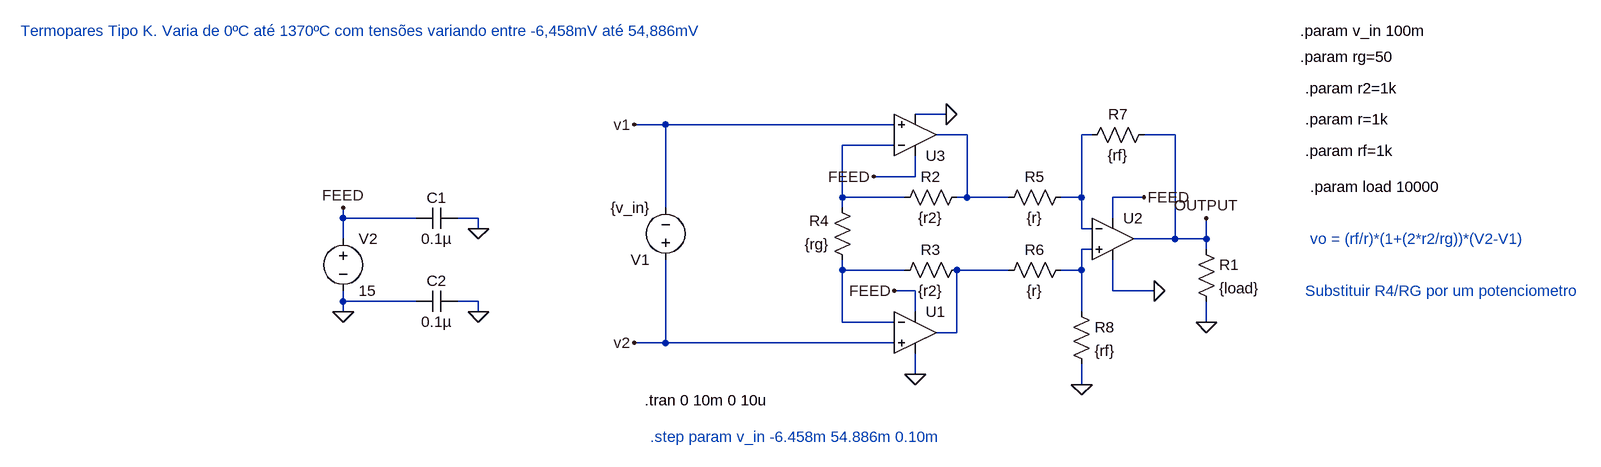
[diagram p0: schematic Amplificador_Instrumentacao.asc]
Amplificador_Instrumentacao.asc, the LTspice schematic file:
Version 4.1
SHEET 1 880 836
WIRE -480 288 -528 288
WIRE -912 304 -960 304
WIRE -560 304 -912 304
WIRE -448 320 -496 320
WIRE -256 320 -272 320
WIRE -128 320 -176 320
WIRE -560 336 -640 336
WIRE -528 384 -528 352
WIRE -528 384 -592 384
WIRE -640 416 -640 336
WIRE -544 416 -640 416
WIRE -448 416 -448 320
WIRE -448 416 -464 416
WIRE -384 416 -448 416
WIRE -272 416 -272 320
WIRE -272 416 -304 416
WIRE -176 416 -224 416
WIRE -912 432 -912 304
WIRE -640 432 -640 416
WIRE -1408 448 -1408 432
WIRE -1296 448 -1408 448
WIRE -1200 448 -1232 448
WIRE -224 448 -224 416
WIRE -1200 464 -1200 448
WIRE -272 464 -272 416
WIRE -256 464 -272 464
WIRE -1408 480 -1408 448
WIRE -128 480 -128 320
WIRE -128 480 -192 480
WIRE -80 480 -80 448
WIRE -80 480 -128 480
WIRE -256 496 -272 496
WIRE -80 496 -80 480
WIRE -640 528 -640 512
WIRE -544 528 -640 528
WIRE -384 528 -464 528
WIRE -272 528 -272 496
WIRE -272 528 -304 528
WIRE -528 560 -560 560
WIRE -224 560 -224 512
WIRE -160 560 -224 560
WIRE -1408 576 -1408 560
WIRE -1296 576 -1408 576
WIRE -1200 576 -1232 576
WIRE -1408 592 -1408 576
WIRE -1200 592 -1200 576
WIRE -528 592 -528 560
WIRE -272 592 -272 528
WIRE -640 608 -640 528
WIRE -560 608 -640 608
WIRE -80 608 -80 576
WIRE -464 624 -464 528
WIRE -464 624 -496 624
WIRE -912 640 -912 512
WIRE -912 640 -960 640
WIRE -560 640 -912 640
WIRE -528 688 -528 656
WIRE -272 704 -272 672
FLAG -1408 432 FEED
FLAG -1408 592 0
FLAG -272 704 0
FLAG -480 288 0
FLAG -528 688 0
FLAG -160 560 0
FLAG -592 384 FEED
FLAG -560 560 FEED
FLAG -176 416 FEED
FLAG -80 608 0
FLAG -80 448 OUTPUT
FLAG -960 640 v2
FLAG -960 304 v1
FLAG -1200 464 0
FLAG -1200 592 0
SYMBOL OpAmps\\UniversalOpAmp -528 624 R0
SYMATTR InstName U1
SYMBOL OpAmps\\UniversalOpAmp -224 480 R0
SYMATTR InstName U2
SYMBOL OpAmps\\UniversalOpAmp -528 320 M180
SYMATTR InstName U3
SYMBOL res -448 400 R90
WINDOW 0 0 56 VBottom 2
WINDOW 3 32 56 VTop 2
SYMATTR InstName R2
SYMATTR Value {r2}
SYMBOL res -448 512 R90
WINDOW 0 0 56 VBottom 2
WINDOW 3 32 56 VTop 2
SYMATTR InstName R3
SYMATTR Value {r2}
SYMBOL res -624 528 R180
WINDOW 0 36 76 Left 2
WINDOW 3 36 40 Left 2
SYMATTR InstName R4
SYMATTR Value {rg}
SYMBOL res -400 432 R270
WINDOW 0 32 56 VTop 2
WINDOW 3 0 56 VBottom 2
SYMATTR InstName R5
SYMATTR Value {r}
SYMBOL res -400 544 R270
WINDOW 0 32 56 VTop 2
WINDOW 3 0 56 VBottom 2
SYMATTR InstName R6
SYMATTR Value {r}
SYMBOL res -272 336 R270
WINDOW 0 32 56 VTop 2
WINDOW 3 0 56 VBottom 2
SYMATTR InstName R7
SYMATTR Value {rf}
SYMBOL res -288 576 R0
SYMATTR InstName R8
SYMATTR Value {rf}
SYMBOL voltage -912 528 R180
WINDOW 123 0 0 Left 0
WINDOW 39 0 0 Left 0
SYMATTR InstName V1
SYMATTR Value {v_in}
SYMBOL res -96 480 R0
SYMATTR InstName R1
SYMATTR Value {load}
SYMBOL voltage -1408 464 R0
WINDOW 123 0 0 Left 0
WINDOW 39 0 0 Left 0
SYMATTR InstName V2
SYMATTR Value 15
SYMBOL cap -1232 432 R90
WINDOW 0 0 32 VBottom 2
WINDOW 3 32 32 VTop 2
SYMATTR InstName C1
SYMATTR Value 0.1µ
SYMBOL cap -1232 560 R90
WINDOW 0 0 32 VBottom 2
WINDOW 3 32 32 VTop 2
SYMATTR InstName C2
SYMATTR Value 0.1µ
TEXT 64 160 Left 2 !.param v_in 100m
TEXT 64 200 Left 2 !.param rg=50
TEXT 72 248 Left 2 !.param r2=1k
TEXT 72 296 Left 2 !.param r=1k
TEXT 72 344 Left 2 !.param rf=1k
TEXT 80 400 Left 2 !.param load 10000
TEXT 80 480 Left 2 ;vo = (rf/r)*(1+(2*r2/rg))*(V2-V1)
TEXT -944 728 Left 2 !.tran 0 10m 0 10u
TEXT 72 560 Left 2 ;Substituir R4/RG por um potenciometro
TEXT -1904 160 Left 2 ;Termopares Tipo K. Varia de 0ºC até 1370ºC com tensões variando entre -6,458mV até 54,886mV
TEXT -936 784 Left 2 ;.step param v_in -6.458m 54.886m 0.10m

The netlist it stands for:
* Amplificador_Instrumentacao.asc
X§U1 v2 N005 FEED 0 N006 level1 Avol=1Meg GBW=10Meg Vos=0 En=0 Enk=0 In=0 Ink=0 Rin=500Meg  ; pins In+ In- V+ V- OUT
X§U2 N004 N002 FEED 0 OUTPUT level1 Avol=1Meg GBW=10Meg Vos=0 En=0 Enk=0 In=0 Ink=0 Rin=500Meg  ; pins In+ In- V+ V- OUT
X§U3 v1 N003 FEED 0 N001 level1 Avol=1Meg GBW=10Meg Vos=0 En=0 Enk=0 In=0 Ink=0 Rin=500Meg  ; pins In+ In- V+ V- OUT
R2 N001 N003 {r2}
R3 N006 N005 {r2}
R4 N005 N003 {rg}
R5 N001 N002 {r}
R6 N006 N004 {r}
R7 N002 OUTPUT {rf}
R8 N004 0 {rf}
V1 v2 v1 {v_in}
R1 OUTPUT 0 {load}
V2 FEED 0 15
C1 0 FEED 0.1µ
C2 0 0 0.1µ
.param v_in 100m
.param rg=50
.param r2=1k
.param r=1k
.param rf=1k
.param load 10000
* vo = (rf/r)*(1+(2*r2/rg))*(V2-V1)
.tran 0 10m 0 10u
* Substituir R4/RG por um potenciometro
* Termopares Tipo K. Varia de 0ºC até 1370ºC com tensões variando entre -6,458mV até 54,886mV
* .step param v_in -6.458m 54.886m 0.10m
.lib UniversalOpAmp1.lib
.backanno
.end